# Altium schematic sheet 1_Main_核心板.schdoc.schdoc
size 431 x 309 mm; Symbol: Sheet-Symbol_A3; Device: Sheet-Symbol_A3; Company: 嘉立创EDA; Version: V1.0; Page Size: A3; @Project Name: 0117_230627_uMSX 4.0; @Page Count: 4; @Update Date: 2023-07-03; @Schematic Name: uMSX 4.0; @Page No: 1; @Page Name: Main/核心板
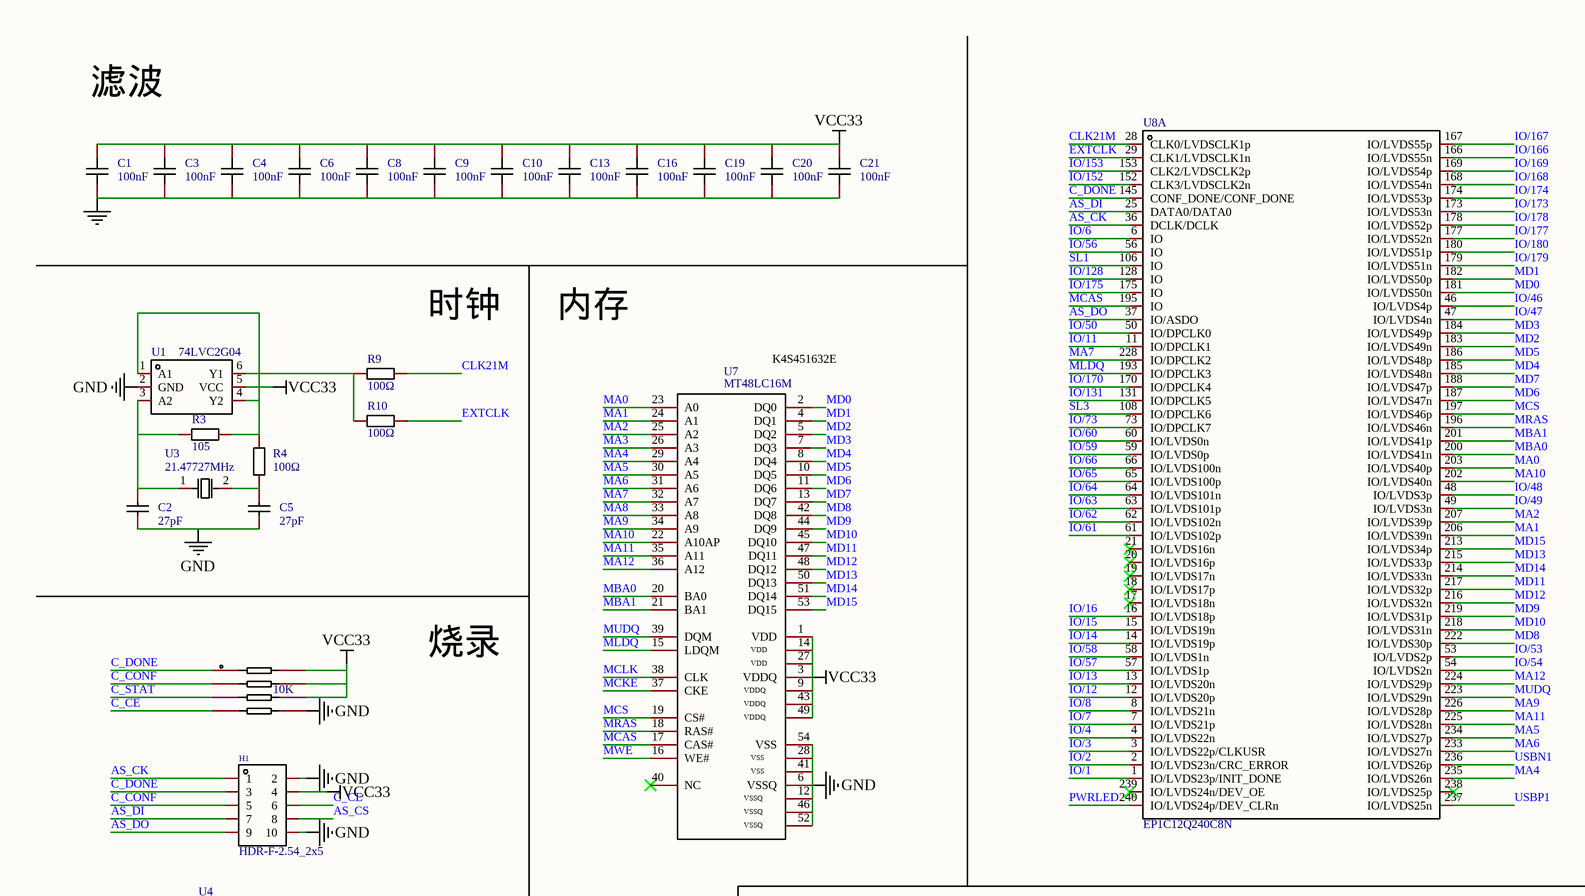
[diagram p0: 1_Main_核心板.schdoc.schdoc, top left]
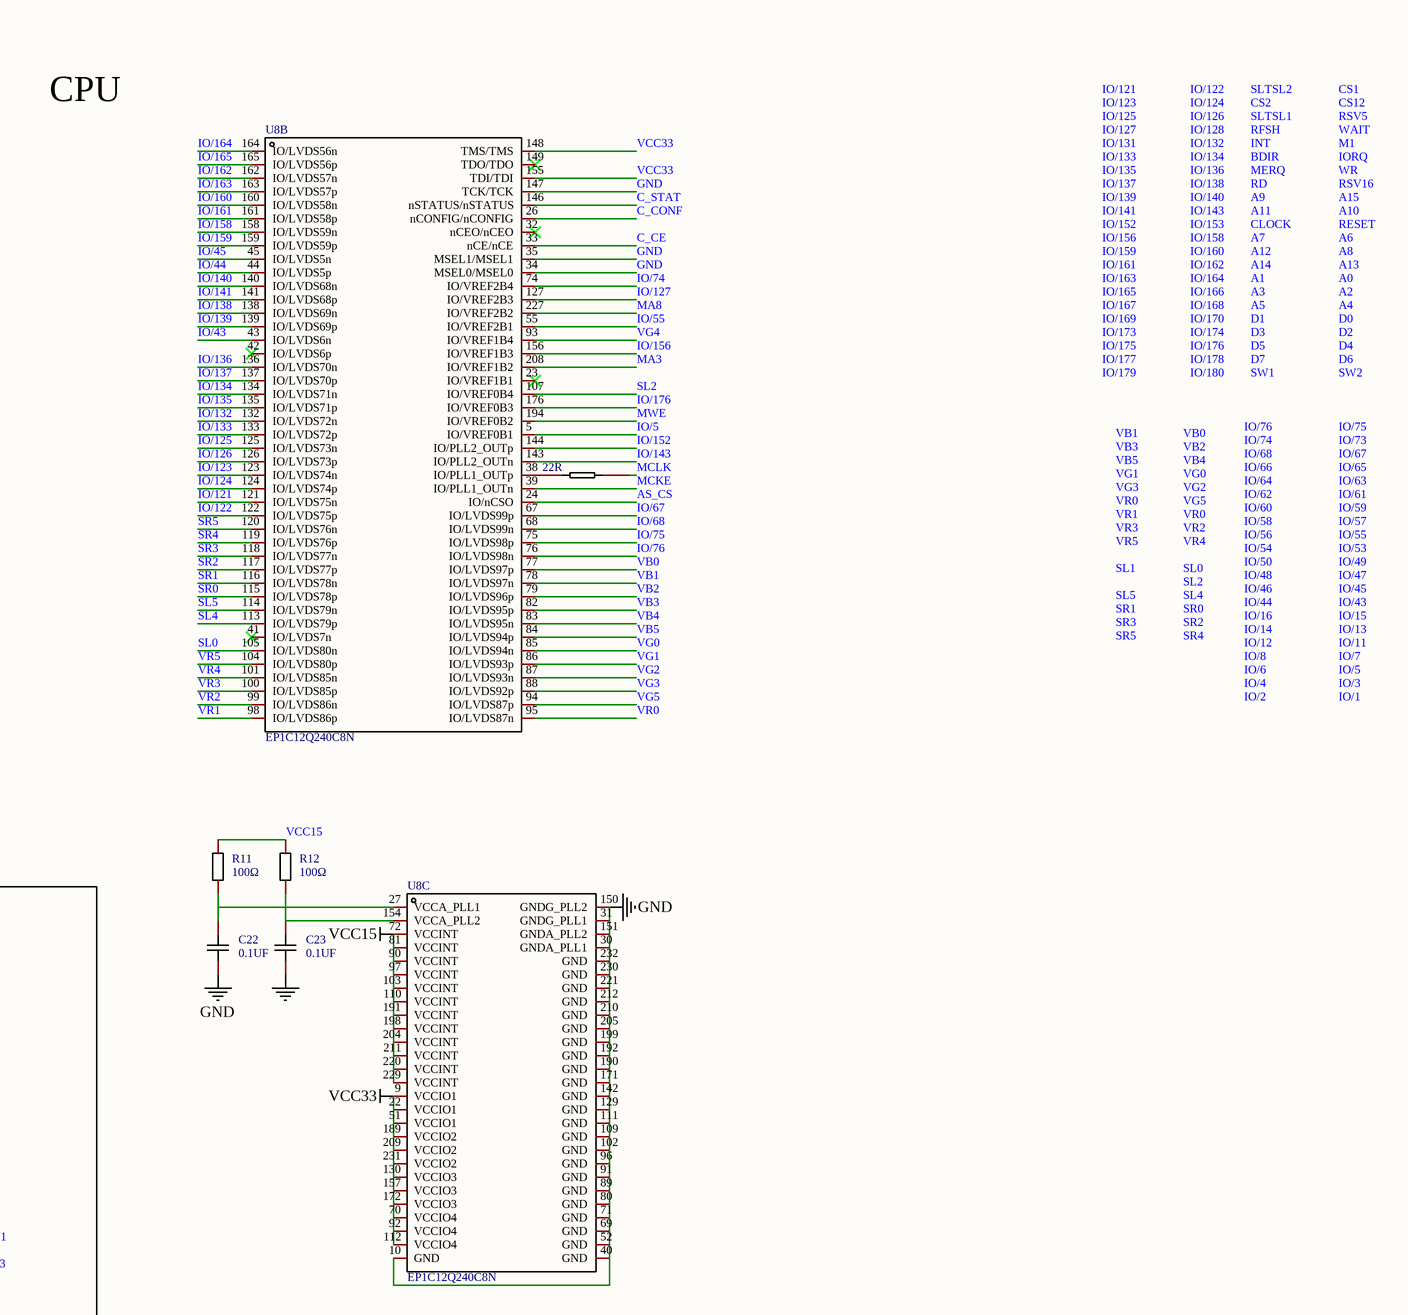
[diagram p1: 1_Main_核心板.schdoc.schdoc, top right]
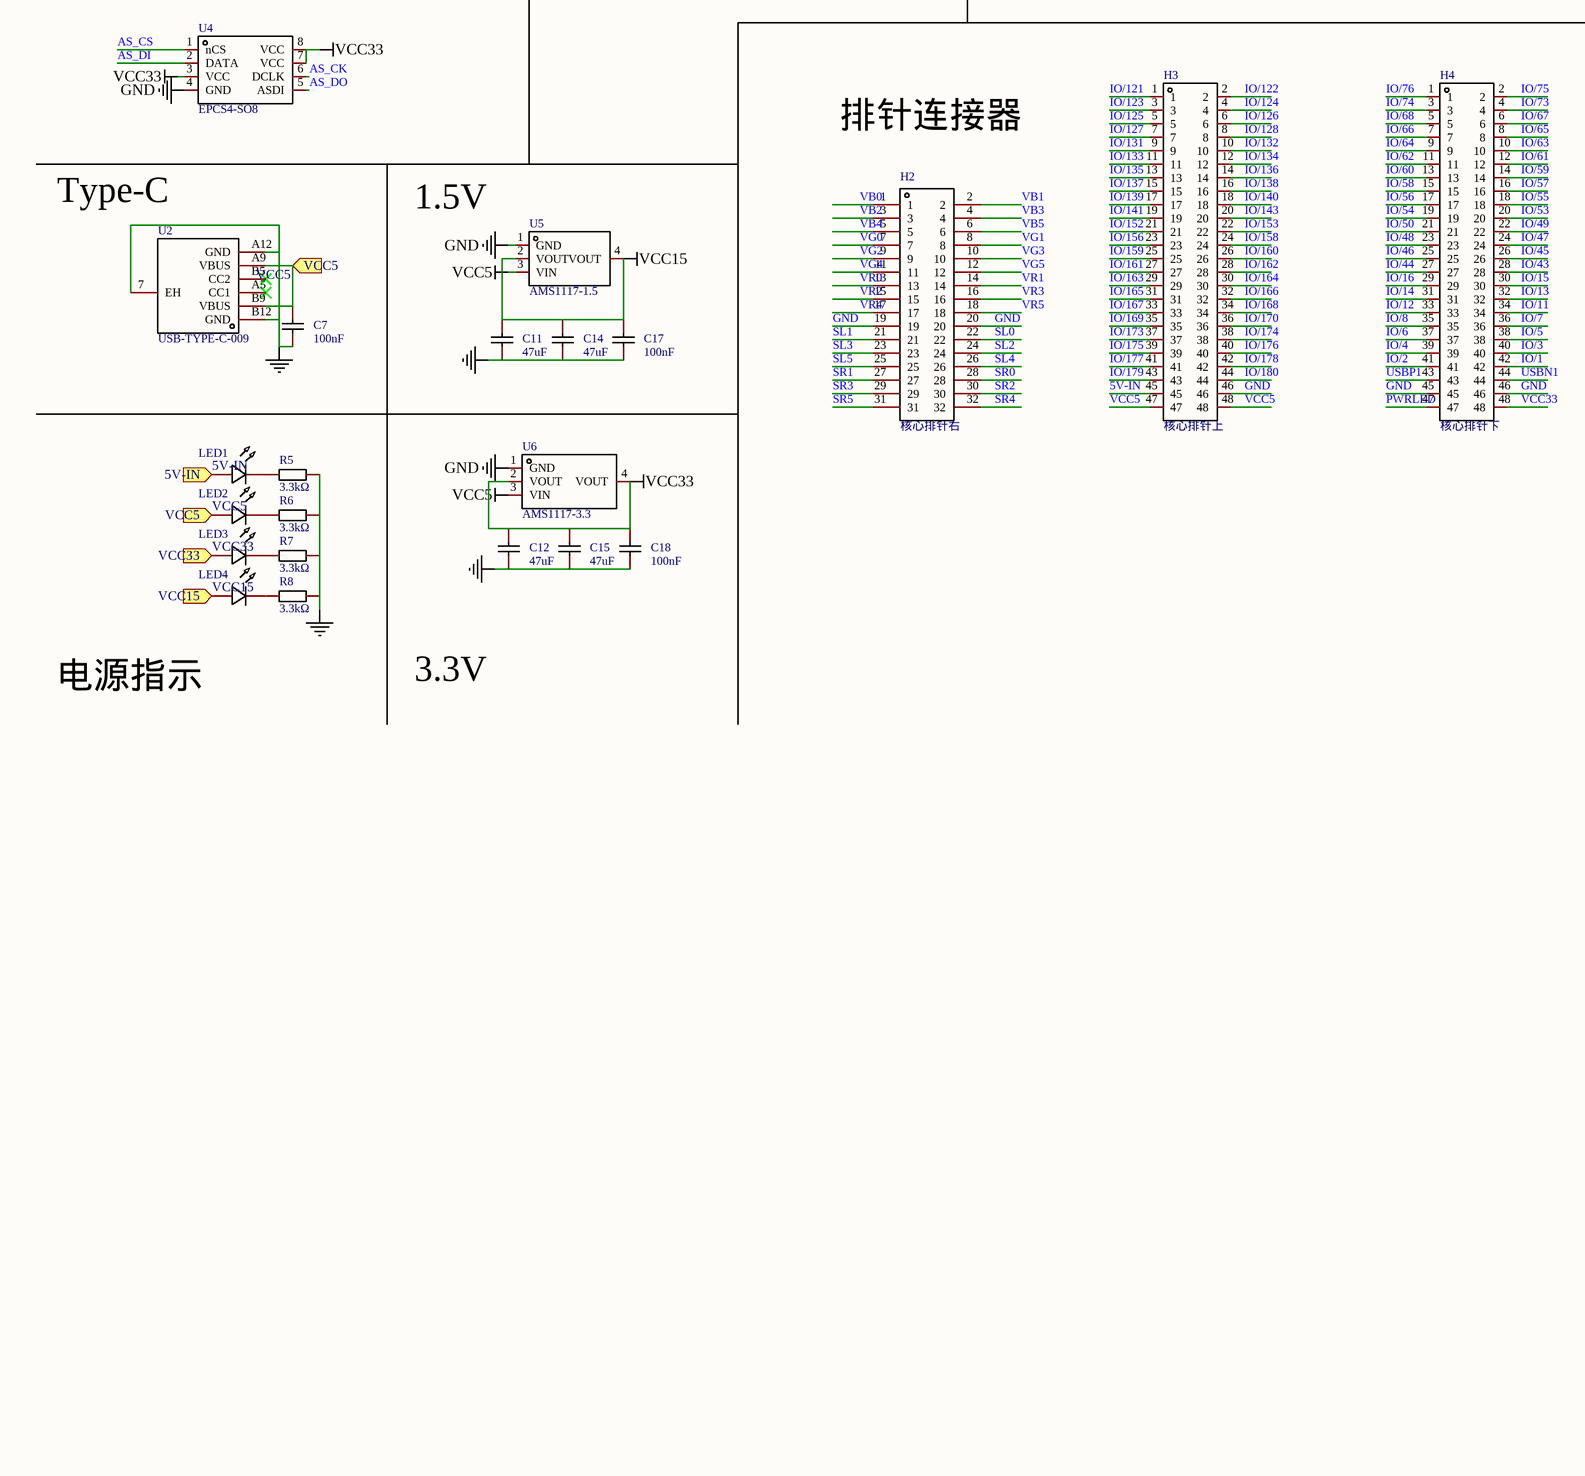
[diagram p2: 1_Main_核心板.schdoc.schdoc, bottom left]

## Parts
C1  100nF  [C0603]
C2  27pF  [C0603]
C3  100nF  [C0603]
C4  100nF  [C0603]
C5  27pF  [C0603]
C6  100nF  [C0603]
C7  100nF  [C0603]
C8  100nF  [C0603]
C9  100nF  [C0603]
C10  100nF  [C0603]
C11  47uF  [C0805]
C12  47uF  [C0805]
C13  100nF  [C0603]
C14  47uF  [C0805]
C15  47uF  [C0805]
C16  100nF  [C0603]
C17  100nF  [C0603]
C18  100nF  [C0603]
C19  100nF  [C0603]
C20  100nF  [C0603]
C21  100nF  [C0603]
C22  0.1UF  [C0603]
C23  0.1UF  [C0603]
H1  HDR-F-2.54_2x5  [HDR-TH_10P-P2.54-V-F-R2-C5-S2.54]
H2  核心排针右  [HDR-TH_32P-P2.54-V-M-R2-C16-S2.54]
H3  核心排针上  [HDR-TH_48P-2.54-V-M-R2-C24-S2.54]
H4  核心排针下  [HDR-TH_48P-2.54-V-M-R2-C24-S2.54]
LED1  LED_0603-R  [LED_0603]  (value not drawn)
LED2  LED_0603-R  [LED_0603]  (value not drawn)
LED3  LED_0603-R  [LED_0603]  (value not drawn)
LED4  LED_0603-R  [LED_0603]  (value not drawn)
R3  105  [R0603]
R4  100Ω  [R0603]
R5  3.3kΩ  [R0603_NEW]
R6  3.3kΩ  [R0603_NEW]
R7  3.3kΩ  [R0603_NEW]
R8  3.3kΩ  [R0603_NEW]
R9  100Ω  [R0603]
R10  100Ω  [R0603]
R11  100Ω  [R0603]
R12  100Ω  [R0603]
R13  22R  [R0603]
RN2  10K  [RES-ARRAY-SMD_0603-8P-L3.2-W1.6-BL]
U1  74LVC2G04  [SC-70-6_L2.2-W1.3-P0.65-LS2.1-BR]
U2  USB-TYPE-C-009  [TYPE-C-SMD_TYPE-C-6P]
U3  21.47727MHz  [HC-49US_L11.0-W4.6-P4.88]
U4  EPCS4-SO8  [SOP-8_L4.9-W3.9-P1.27-LS6.0-BL]
U5  AMS1117-1.5  [SOT-223_L6.3-W3.5-P2.30-LS7.0-BR]
U6  AMS1117-3.3  [SOT-223-3_L6.5-W3.4-P2.30-LS7.0-BR]
U7  MT48LC16M  [TSOP54]
U8  EP1C12Q240C8N  [MQFP-240_L32.0-W32.0-P0.50-LS34.6-BL]  (parts A,B,C of 3)

## Ports
5V-IN (in), VCC5 (in), VCC15 (in), VCC33 (in)

## Nets
GND: C2.1 C5.1 C22.2 H1.2 H1.10 H2.19 H2.20 H3.46 H4.45 H4.46 RN2.5 U1.2(GND) U4.4(GND) U5.1(GND) U6.1(GND) U7.6(VSSQ) U7.12(VSSQ) U7.28(VSS) U7.41(VSS) U7.46(VSSQ) U7.52(VSSQ) U7.54(VSS) U8.10(GND) U8.30(GNDA_PLL1) U8.31(GNDG_PLL1) U8.34(MSEL0/MSEL0) U8.35(MSEL1/MSEL1) U8.40(GND) U8.52(GND) U8.69(GND) U8.71(GND) U8.80(GND) U8.89(GND) U8.91(GND) U8.96(GND) U8.102(GND) U8.109(GND) U8.111(GND) U8.129(GND) U8.142(GND) U8.147(TCK/TCK) U8.150(GNDG_PLL2) U8.151(GNDA_PLL2) U8.171(GND) U8.190(GND) U8.192(GND) U8.199(GND) U8.205(GND) U8.210(GND) U8.212(GND) U8.221(GND) U8.230(GND) U8.232(GND)
NetC1_1: C1.1 C3.1 C4.1 C6.1 C7.1 C8.1 C9.1 C10.1 C11.1 C12.1 C13.1 C14.1 C15.1 C16.1 C17.1 C18.1 C19.1 C20.1 C21.1 C23.2 R5.2 R6.2 R7.2 R8.2 U2.7(EH) U2.A12(GND) U2.B12(GND)
VCC5: C7.2 H3.47 H3.48 LED2.2(A) U2.A9(VBUS) U2.B9(VBUS) U5.3(VIN) U6.3(VIN) ; port VCC5
VCC15: C11.2 C14.2 C17.2 LED4.2(A) R11.2 R12.2 U5.2(VOUT) U5.4(VOUT) U8.72(VCCINT) U8.81(VCCINT) U8.90(VCCINT) U8.97(VCCINT) U8.103(VCCINT) U8.110(VCCINT) U8.191(VCCINT) U8.198(VCCINT) U8.204(VCCINT) U8.211(VCCINT) U8.220(VCCINT) U8.229(VCCINT) ; port VCC15
VCC33: C1.2 C3.2 C4.2 C6.2 C8.2 C9.2 C10.2 C12.2 C13.2 C15.2 C16.2 C18.2 C19.2 C20.2 C21.2 H1.4 H4.48 LED3.2(A) RN2.6 RN2.7 RN2.8 U1.5(VCC) U4.3(VCC) U4.7(VCC) U4.8(VCC) U6.2(VOUT) U6.4(VOUT) U7.1(VDD) U7.3(VDDQ) U7.9(VDDQ) U7.14(VDD) U7.27(VDD) U7.43(VDDQ) U7.49(VDDQ) U8.9(VCCIO1) U8.22(VCCIO1) U8.51(VCCIO1) U8.70(VCCIO4) U8.92(VCCIO4) U8.112(VCCIO4) U8.130(VCCIO3) U8.148(TMS/TMS) U8.155(TDI/TDI) U8.157(VCCIO3) U8.172(VCCIO3) U8.189(VCCIO2) U8.209(VCCIO2) U8.231(VCCIO2) ; port VCC33
5V-IN: H3.45 LED1.2(A) ; port 5V-IN
AS_CK: H1.1 U4.6(DCLK) U8.36(DCLK/DCLK)
AS_CS: H1.8 U4.1(nCS) U8.24(IO/nCSO)
AS_DI: H1.7 U4.2(DATA) U8.25(DATA0/DATA0)
AS_DO: H1.9 U4.5(ASDI) U8.37(IO/ASDO)
C_CE: H1.6 RN2.4 U8.33(nCE/nCE)
C_CONF: H1.5 RN2.2 U8.26(nCONFIG/nCONFIG)
C_DONE: H1.3 RN2.1 U8.145(CONF_DONE/CONF_DONE)
C_STAT: RN2.3 U8.146(nSTATUS/nSTATUS)
CLK21M: R9.2 U8.28(CLK0/LVDSCLK1p)
EXTCLK: R10.2 U8.29(CLK1/LVDSCLK1n)
IO/1: H4.42 U8.1(IO/LVDS23p/INIT_DONE)
IO/2: H4.41 U8.2(IO/LVDS23n/CRC_ERROR)
IO/3: H4.40 U8.3(IO/LVDS22p/CLKUSR)
IO/4: H4.39 U8.4(IO/LVDS22n)
IO/5: H4.38 U8.5(IO/VREF0B1)
IO/6: H4.37 U8.6(IO)
IO/7: H4.36 U8.7(IO/LVDS21p)
IO/8: H4.35 U8.8(IO/LVDS21n)
IO/11: H4.34 U8.11(IO/DPCLK1)
IO/12: H4.33 U8.12(IO/LVDS20p)
IO/13: H4.32 U8.13(IO/LVDS20n)
IO/14: H4.31 U8.14(IO/LVDS19p)
IO/15: H4.30 U8.15(IO/LVDS19n)
IO/16: H4.29 U8.16(IO/LVDS18p)
IO/43: H4.28 U8.43(IO/LVDS6n)
IO/44: H4.27 U8.44(IO/LVDS5p)
IO/45: H4.26 U8.45(IO/LVDS5n)
IO/46: H4.25 U8.46(IO/LVDS4p)
IO/47: H4.24 U8.47(IO/LVDS4n)
IO/48: H4.23 U8.48(IO/LVDS3p)
IO/49: H4.22 U8.49(IO/LVDS3n)
IO/50: H4.21 U8.50(IO/DPCLK0)
IO/53: H4.20 U8.53(IO/LVDS2p)
IO/54: H4.19 U8.54(IO/LVDS2n)
IO/55: H4.18 U8.55(IO/VREF2B1)
IO/56: H4.17 U8.56(IO)
IO/57: H4.16 U8.57(IO/LVDS1p)
IO/58: H4.15 U8.58(IO/LVDS1n)
IO/59: H4.14 U8.59(IO/LVDS0p)
IO/60: H4.13 U8.60(IO/LVDS0n)
IO/61: H4.12 U8.61(IO/LVDS102p)
IO/62: H4.11 U8.62(IO/LVDS102n)
IO/63: H4.10 U8.63(IO/LVDS101p)
IO/64: H4.9 U8.64(IO/LVDS101n)
IO/65: H4.8 U8.65(IO/LVDS100p)
IO/66: H4.7 U8.66(IO/LVDS100n)
IO/67: H4.6 U8.67(IO/LVDS99p)
IO/68: H4.5 U8.68(IO/LVDS99n)
IO/73: H4.4 U8.73(IO/DPCLK7)
IO/74: H4.3 U8.74(IO/VREF2B4)
IO/75: H4.2 U8.75(IO/LVDS98p)
IO/76: H4.1 U8.76(IO/LVDS98n)
IO/121: H3.1 U8.121(IO/LVDS75n)
IO/122: H3.2 U8.122(IO/LVDS75p)
IO/123: H3.3 U8.123(IO/LVDS74n)
IO/124: H3.4 U8.124(IO/LVDS74p)
IO/125: H3.5 U8.125(IO/LVDS73n)
IO/126: H3.6 U8.126(IO/LVDS73p)
IO/127: H3.7 U8.127(IO/VREF2B3)
IO/128: H3.8 U8.128(IO)
IO/131: H3.9 U8.131(IO/DPCLK5)
IO/132: H3.10 U8.132(IO/LVDS72n)
IO/133: H3.11 U8.133(IO/LVDS72p)
IO/134: H3.12 U8.134(IO/LVDS71n)
IO/135: H3.13 U8.135(IO/LVDS71p)
IO/136: H3.14 U8.136(IO/LVDS70n)
IO/137: H3.15 U8.137(IO/LVDS70p)
IO/138: H3.16 U8.138(IO/LVDS69n)
IO/139: H3.17 U8.139(IO/LVDS69p)
IO/140: H3.18 U8.140(IO/LVDS68n)
IO/141: H3.19 U8.141(IO/LVDS68p)
IO/143: H3.20 U8.143(IO/PLL2_OUTn)
IO/152: H3.21 U8.144(IO/PLL2_OUTp) U8.152(CLK3/LVDSCLK2n)
IO/153: H3.22 U8.153(CLK2/LVDSCLK2p)
IO/156: H3.23 U8.156(IO/VREF1B3)
IO/158: H3.24 U8.158(IO/LVDS59n)
IO/159: H3.25 U8.159(IO/LVDS59p)
IO/160: H3.26 U8.160(IO/LVDS58n)
IO/161: H3.27 U8.161(IO/LVDS58p)
IO/162: H3.28 U8.162(IO/LVDS57n)
IO/163: H3.29 U8.163(IO/LVDS57p)
IO/164: H3.30 U8.164(IO/LVDS56n)
IO/165: H3.31 U8.165(IO/LVDS56p)
IO/166: H3.32 U8.166(IO/LVDS55n)
IO/167: H3.33 U8.167(IO/LVDS55p)
IO/168: H3.34 U8.168(IO/LVDS54n)
IO/169: H3.35 U8.169(IO/LVDS54p)
IO/170: H3.36 U8.170(IO/DPCLK4)
IO/173: H3.37 U8.173(IO/LVDS53n)
IO/174: H3.38 U8.174(IO/LVDS53p)
IO/175: H3.39 U8.175(IO)
IO/176: H3.40 U8.176(IO/VREF0B3)
IO/177: H3.41 U8.177(IO/LVDS52n)
IO/178: H3.42 U8.178(IO/LVDS52p)
IO/179: H3.43 U8.179(IO/LVDS51n)
IO/180: H3.44 U8.180(IO/LVDS51p)
MA0: U7.23(A0) U8.203(IO/LVDS40p)
MA1: U7.24(A1) U8.206(IO/LVDS39n)
MA2: U7.25(A2) U8.207(IO/LVDS39p)
MA3: U7.26(A3) U8.208(IO/VREF1B2)
MA4: U7.29(A4) U8.235(IO/LVDS26n)
MA5: U7.30(A5) U8.234(IO/LVDS27p)
MA6: U7.31(A6) U8.233(IO/LVDS27n)
MA7: U7.32(A7) U8.228(IO/DPCLK2)
MA8: U7.33(A8) U8.227(IO/VREF2B2)
MA9: U7.34(A9) U8.226(IO/LVDS28p)
MA10: U7.22(A10AP) U8.202(IO/LVDS40n)
MA11: U7.35(A11) U8.225(IO/LVDS28n)
MA12: U7.36(A12) U8.224(IO/LVDS29p)
MBA0: U7.20(BA0) U8.200(IO/LVDS41n)
MBA1: U7.21(BA1) U8.201(IO/LVDS41p)
MCAS: U7.17(CAS#) U8.195(IO)
MCKE: U7.37(CKE) U8.39(IO/PLL1_OUTn)
MCLK: R13.2 U7.38(CLK)
MCS: U7.19(CS#) U8.197(IO/LVDS46p)
MD0: U7.2(DQ0) U8.181(IO/LVDS50n)
MD1: U7.4(DQ1) U8.182(IO/LVDS50p)
MD2: U7.5(DQ2) U8.183(IO/LVDS49n)
MD3: U7.7(DQ3) U8.184(IO/LVDS49p)
MD4: U7.8(DQ4) U8.185(IO/LVDS48n)
MD5: U7.10(DQ5) U8.186(IO/LVDS48p)
MD6: U7.11(DQ6) U8.187(IO/LVDS47n)
MD7: U7.13(DQ7) U8.188(IO/LVDS47p)
MD8: U7.42(DQ8) U8.222(IO/LVDS30p)
MD9: U7.44(DQ9) U8.219(IO/LVDS31p)
MD10: U7.45(DQ10) U8.218(IO/LVDS31n)
MD11: U7.47(DQ11) U8.217(IO/LVDS32p)
MD12: U7.48(DQ12) U8.216(IO/LVDS32n)
MD13: U7.50(DQ13) U8.215(IO/LVDS33p)
MD14: U7.51(DQ14) U8.214(IO/LVDS33n)
MD15: U7.53(DQ15) U8.213(IO/LVDS34p)
MLDQ: U7.15(LDQM) U8.193(IO/DPCLK3)
MRAS: U7.18(RAS#) U8.196(IO/LVDS46n)
MUDQ: U7.39(DQM) U8.223(IO/LVDS29n)
MWE: U7.16(WE#) U8.194(IO/VREF0B2)
PWRLED: H4.47 U8.240(IO/LVDS24p/DEV_CLRn)
SL0: H2.22 U8.105(IO/LVDS80n)
SL1: H2.21 U8.106(IO)
SL2: H2.24 U8.107(IO/VREF0B4)
SL3: H2.23 U8.108(IO/DPCLK6)
SL4: H2.26 U8.113(IO/LVDS79p)
SL5: H2.25 U8.114(IO/LVDS79n)
SR0: H2.28 U8.115(IO/LVDS78p)
SR1: H2.27 U8.116(IO/LVDS78n)
SR2: H2.30 U8.117(IO/LVDS77p)
SR3: H2.29 U8.118(IO/LVDS77n)
SR4: H2.32 U8.119(IO/LVDS76p)
SR5: H2.31 U8.120(IO/LVDS76n)
USBN1: H4.44 U8.236(IO/LVDS26p)
USBP1: H4.43 U8.237(IO/LVDS25n)
VB0: H2.1 U8.77(IO/LVDS97p)
VB1: H2.2 U8.78(IO/LVDS97n)
VB2: H2.3 U8.79(IO/LVDS96p)
VB3: H2.4 U8.82(IO/LVDS95p)
VB4: H2.5 U8.83(IO/LVDS95n)
VB5: H2.6 U8.84(IO/LVDS94p)
VG0: H2.7 U8.85(IO/LVDS94n)
VG1: H2.8 U8.86(IO/LVDS93p)
VG2: H2.9 U8.87(IO/LVDS93n)
VG3: H2.10 U8.88(IO/LVDS92p)
VG4: H2.11 U8.93(IO/VREF1B4)
VG5: H2.12 U8.94(IO/LVDS87p)
VR0: H2.13 U8.95(IO/LVDS87n)
VR1: H2.14 U8.98(IO/LVDS86p)
VR2: H2.15 U8.99(IO/LVDS86n)
VR3: H2.16 U8.100(IO/LVDS85p)
VR4: H2.17 U8.101(IO/LVDS85n)
VR5: H2.18 U8.104(IO/LVDS80p)
NetC2_2: C2.2 R3.1 U1.3(A2) U3.1(OSC1)
NetC5_2: C5.2 R4.1 U3.2(OSC2)
NetC22_1: C22.1 R11.1 U8.27(VCCA_PLL1)
NetC23_1: C23.1 R12.1 U8.154(VCCA_PLL2)
NetLED1_1: LED1.1(C) R5.1
NetLED2_1: LED2.1(C) R6.1
NetLED3_1: LED3.1(C) R7.1
NetLED4_1: LED4.1(C) R8.1
NetR3_2: R3.2 R4.2 U1.1(A1) U1.4(Y2)
NetR9_1: R9.1 R10.1 U1.6(Y1)
NetR13_1: R13.1 U8.38(IO/PLL1_OUTp)

Not connected (* = marked no-connect by the designer): U2 A5(CC1)* B5(CC2)*; U7 40(NC)*; U8 17(IO/LVDS18n)* 18(IO/LVDS17p)* 19(IO/LVDS17n)* 20(IO/LVDS16p)* 21(IO/LVDS16n)* 23(IO/VREF1B1)* 32(nCEO/nCEO)* 41(IO/LVDS7n)* 42(IO/LVDS6p)* 149(TDO/TDO)* 238(IO/LVDS25p)* 239(IO/LVDS24n/DEV_OE)*

## Notes on the sheet
- 滤波
- CPU
- 时钟
- 内存
- (near U7) K4S451632E
- 烧录
- 排针连接器
- (near U2) Type-C
- (near U5) 1.5V
- 电源指示
- 3.3V
- Labels drawn without touching a wire or pin: A0, A1, A2, A3, A4, A5, A6, A7, A8, A9, A10, A11, A12, A13, A14, A15, BDIR, CLOCK, CS1, CS2, CS12, D0, D1, D2, D3, D4, D5, D6, D7, INT, IO/1, IO/2, IO/3, IO/4, IO/5, IO/6, IO/7, IO/8, IO/11, IO/12, IO/13, IO/14, IO/15, IO/16, IO/43, IO/44, IO/45, IO/46, IO/47, IO/48, IO/49, IO/50, IO/53, IO/54, IO/55, IO/56, IO/57, IO/58, IO/59, IO/60, IO/61, IO/62, IO/63, IO/64, IO/65, IO/66, IO/67, IO/68, IO/73, IO/74, IO/75, IO/76, IO/121, IO/122, IO/123, IO/124, IO/125, IO/126, IO/127, IO/128, IO/131, IO/132, IO/133, IO/134, IO/135, IO/136, IO/137, IO/138, IO/139, IO/140, IO/141, IO/143, IO/152, IO/153, IO/156, IO/158, IO/159, IO/160, IO/161, IO/162, IO/163, IO/164, IO/165, IO/166, IO/167, IO/168, IO/169, IO/170, IO/173, IO/174, IO/175, IO/176, IO/177, IO/178, IO/179, IO/180, IORQ, M1, MERQ, RD, RESET, RFSH, RSV5, RSV16, SL0, SL1, SL2, SL4, SL5, SLTSL1, SLTSL2, SR0, SR1, SR2, SR3, SR4, SR5, SW1, SW2, VB0, VB1, VB2, VB3, VB4, VB5, VG0, VG1, VG2, VG3, VG5, VR0, VR1, VR2, VR3, VR4, VR5, WAIT, WR
- 1
- 2
- 3
- 4
- 5
- 6
- A
- B
- C
- Schematic
- uMSX 4.0
- Create Date
- Update Date
- 2023-07-03
- D
- Reviewed
- Drawed
- Page
- Main/核心板
- Part Number
- 0117_230627_uMSX 4.0
- VER
- SIZE
- PAGE
- OF
- V1.0
- A3
- 嘉立创EDA

## Library data of the parts
C1 C3 C4 C6 C8-C10 C13 C16 C19-C21 = CC0603KRX7R9BB104: Manufacturer: YAGEO(国巨); Add into BOM: yes; Tolerance: ±10%; Voltage Rated: 50V; Temperature Coefficient: X7R; Description: 容值:100nF;精度:±10%;额定电压:50V;材质(温度系数):X7R;; Name: 100nF; Symbol: CC0603KRX7R9BB104; Device: CC0603KRX7R9BB104; LCSC Part Name: 100nF ±10% 50V; Supplier Part: C14663; Manufacturer Part: CC0603KRX7R9BB104; Supplier Footprint: 0603; JLCPCB Part Class: Basic Part; Datasheet: https://atta.szlcsc.com/upload/public/pdf/source/20180910/C282072_33301C7F631E79921B82A8DAC6BCC5B3.pdf; Supplier: LCSC; Convert to PCB: yes; Value: 100nF
C2 C5 = CC0603JRNPO9BN270: Manufacturer: YAGEO(国巨); Add into BOM: yes; Tolerance: ±5%; Voltage Rated: 50V; Temperature Coefficient: NP0; Description: 容值:27pF;精度:±5%;额定电压:50V;材质(温度系数):NP0;; Name: 27pF; Symbol: CC0603JRNPO9BN270; Device: CC0603JRNPO9BN270; LCSC Part Name: 27pF ±5% 50V; Supplier Part: C107045; Manufacturer Part: CC0603JRNPO9BN270; Supplier Footprint: 0603; JLCPCB Part Class: Basic Part; Datasheet: https://atta.szlcsc.com/upload/public/pdf/source/20170420/1492670692625.pdf; Supplier: LCSC; Convert to PCB: yes; Value: 27pF
C7 C17 C18 = 0603B104K500NT: Manufacturer: FH(风华); Add into BOM: yes; Tolerance: ±10%; Voltage Rated: 50V; Temperature Coefficient: X7R; Description: 容值:100nF;精度:±10%;额定电压:50V;材质(温度系数):X7R;; Name: 100nF; Symbol: 0603B104K500NT; Device: 0603B104K500NT; LCSC Part Name: 100nF ±10% 50V; Supplier Part: C30926; Manufacturer Part: 0603B104K500NT; Supplier Footprint: 0603; JLCPCB Part Class: Extended Part; Datasheet: https://atta.szlcsc.com/upload/public/pdf/source/20170923/C30926_1506149436298988724.pdf; Supplier: LCSC; Convert to PCB: yes; Value: 100nF
C11 C12 C14 C15 = CL21A476MQYNNNE: Manufacturer: SAMSUNG(三星); Add into BOM: yes; Tolerance: ±20%; Voltage Rated: 6.3V; Temperature Coefficient: X5R; Description: 容值:47uF;精度:±20%;额定电压:6.3V;材质(温度系数):X5R;; Name: 47uF; Symbol: CL21A476MQYNNNE; Device: CL21A476MQYNNNE; LCSC Part Name: 47uF ±20% 6.3V; Supplier Part: C16780; Manufacturer Part: CL21A476MQYNNNE; Supplier Footprint: 0805; JLCPCB Part Class: Basic Part; Datasheet: https://atta.szlcsc.com/upload/public/pdf/source/20160103/1457707690276.pdf; Supplier: LCSC; Convert to PCB: yes; Value: 47uF
C22 C23 = 0.1UF: 3DModel: C0603_L1.6-W0.8-H0.8; Add into BOM: yes; Name: 0.1UF; Symbol: 0.1UF; Device: 0.1UF; link: https://item.szlcsc.com/362304.html; Convert to PCB: yes; Origin Footprint: C0603
H1 = 排母2.54mm2*5p 直: Manufacturer: BOOMELE(博穆精密); Symbol: Female header2.54mm2*5p Straight; Add into BOM: yes; Number of Holes: 10P; Pitch: 2.54mm; Description: 排数:双排;总孔位数:10P;间距:2.54mm;行距:2.54mm;安装类型:直插;塑高:-;触头材质:黄铜;触头镀层:-;; Name: HDR-F-2.54_2x5; Device: 排母2.54mm2*5p 直; Supplier Part: C30419; Supplier: LCSC; Manufacturer Part: HDR-F-2.54_2x5; JLCPCB Part Class: Extended Part; LCSC Part Name: 2.54mm; Supplier Footprint: 插件,P=2.54mm; Convert to PCB: yes; Number of Rows: 双排; Row Spacing: 2.54mm; Mounting Type: 直插; Insulation Height: -; Contact Material: 黄铜; Contact Plating: -
H2 = B-2100S32P-B110: Manufacturer: Ckmtw(灿科盟); Symbol: 210S-2*16P L=11.6MMGold-plated black; Add into BOM: yes; Pitch: 2.54mm; Pin Structure: 2x16P; Description: 排数:双排;总PIN位数:32;间距:2.54mm;插针结构:2x16P;行距:2.54mm;安装类型:直插;圆针/方针:-;额定电流:-;额定电压:-;配合针长度:6mm;塑高:2.54mm;端接针长度:3mm;触头材质:黄铜;触头镀层:-;工作温度范围:-40℃~+105℃;颜色:黑色;; Name: 核心排针右; Device: B-2100S32P-B110; LCSC Part Name: 2.54mm 2x16P 直插; Supplier Part: C124382; Manufacturer Part: 核心排针右; Supplier Footprint: 直插,P=2.54mm; JLCPCB Part Class: Extended Part; Datasheet: https://atta.szlcsc.com/upload/public/pdf/source/20170821/C124382_1503303309726901536.pdf; Supplier: LCSC; Convert to PCB: yes; Number of Rows: 双排; Number of Pins: 32; Row Spacing: 2.54mm; Mounting Type: 直插; Circluar Pins/Square Pins: -; Current Rating (Max): -; Voltage Rating (Max): -; Length of Mating Pin: 6mm; Insulation Height: 2.54mm; Length of End Connection Pin: 3mm; Contact Material: 黄铜; Contact Plating: -; Operating Temperature Range: -40℃~+105℃; Color: 黑色
H3 H4 = X6521WV-2x24H-C60D30: Manufacturer: XKB Connectivity(中国星坤); Symbol: X6521WV-2×24H-C30D60; Add into BOM: yes; Pitch: 2.54mm; Pin Structure: 2x24P; Circluar Pins/Square Pins: 方针; Current Rating (Max): 3A; Voltage Rating (Max): 250V; Welding Temperature (Max): 260℃; Description: 排数:双排;总PIN位数:48;间距:2.54mm;插针结构:2x24P;行距:2.54mm;安装类型:直插;圆针/方针:方针;额定电流:3A;额定电压:250V;配合针长度:6mm;塑高:2.5mm;端接针长度:3mm;触头材质:黄铜;触头镀层:金;工作温度范围:-40℃~+105℃;焊接温度(最大值):260℃;颜色:黑色;; Device: X6521WV-2x24H-C60D30; LCSC Part Name: 2.54mm 2x24P 直插 方针 高镀金 抗氧化; Supplier Part: C725896; Supplier Footprint: 插件,P=2.54mm; JLCPCB Part Class: Extended Part; Datasheet: https://atta.szlcsc.com/upload/public/pdf/source/20211009/DE33EBA4104B5B447A7BD8383FBBA145.pdf; Supplier: LCSC; Convert to PCB: yes; Number of Rows: 双排; Number of Pins: 48; Row Spacing: 2.54mm; Mounting Type: 直插; Length of Mating Pin: 6mm; Insulation Height: 2.5mm; Length of End Connection Pin: 3mm; Contact Material: 黄铜; Contact Plating: 金; Operating Temperature Range: -40℃~+105℃; Color: 黑色
  H3: Name: 核心排针上; Manufacturer Part: 核心排针上
  H4: Name: 核心排针下; Manufacturer Part: 核心排针下
LED1-LED4 = LED_0603-R: Symbol: LED_R; Convert to PCB: yes; Device: LED_0603-R; Add into BOM: yes; Supplier Footprint: 0603
R3 = 0603WAF1004T5E: Manufacturer: UNI-ROYAL(厚声); Add into BOM: yes; Tolerance: ±1%; Power(Watts): 100mW; Temperature Coefficient: ±100ppm/℃; Overload Voltage (Max): 75V; Description: 电阻类型:厚膜电阻;阻值:1MΩ;精度:±1%;功率:100mW;; Name: 105; Symbol: 0603WAF1004T5E; Device: 0603WAF1004T5E; LCSC Part Name: 1MΩ ±1% 100mW; Supplier Part: C22935; Manufacturer Part: 0603WAF1004T5E; Supplier Footprint: 0603; JLCPCB Part Class: Basic Part; Datasheet: https://atta.szlcsc.com/upload/public/pdf/source/20200306/C422600_1E6D84923E4A46A82E41ADD87F860B5C.pdf; Supplier: LCSC; Convert to PCB: yes; Type: 厚膜电阻; Value: 105; Operating Temperature Range: -55℃~+155℃
R4 R9-R12 = 0603WAF1000T5E: Manufacturer: UNI-ROYAL(厚声); Add into BOM: yes; Tolerance: ±1%; Power(Watts): 100mW; Temperature Coefficient: ±200ppm/℃; Overload Voltage (Max): 75V; Description: 电阻类型:厚膜电阻;阻值:100Ω;精度:±1%;功率:100mW;; Name: 100Ω; Symbol: 0603WAF1000T5E; Device: 0603WAF1000T5E; LCSC Part Name: 100Ω ±1% 100mW; Supplier Part: C22775; Manufacturer Part: 0603WAF1000T5E; Supplier Footprint: 0603; JLCPCB Part Class: Basic Part; Datasheet: https://atta.szlcsc.com/upload/public/pdf/source/20200306/C422600_1E6D84923E4A46A82E41ADD87F860B5C.pdf; Supplier: LCSC; Convert to PCB: yes; Type: 厚膜电阻; Value: 100Ω; Operating Temperature Range: -55℃~+155℃
R5-R8 = 0603WAF3301T5E: Manufacturer: UNI-ROYAL(厚声); Add into BOM: yes; Tolerance: ±1%; Power(Watts): 100mW; Temperature Coefficient: ±100ppm/℃; Overload Voltage (Max): 75V; Description: 电阻类型:厚膜电阻;阻值:3.3kΩ;精度:±1%;功率:100mW;; Name: 3.3kΩ; Symbol: 0603WAF3301T5E; Device: 0603WAF3301T5E; LCSC Part Name: 3.3kΩ ±1% 100mW; Supplier Part: C22978; Manufacturer Part: 0603WAF3301T5E; Supplier Footprint: 0603; JLCPCB Part Class: Basic Part; Datasheet: https://atta.szlcsc.com/upload/public/pdf/source/20200306/C422600_1E6D84923E4A46A82E41ADD87F860B5C.pdf; Supplier: LCSC; Convert to PCB: yes; Type: 厚膜电阻; Value: 3.3kΩ; Operating Temperature Range: -55℃~+155℃
R13 = Res_0603: Symbol: 电阻; Convert to PCB: yes; Name: 22R; Device: Res_0603; Add into BOM: yes; Supplier Footprint: 0603; Value: 22R
RN2 = 4D03WGJ0101T5E: Manufacturer: UNI-ROYAL(厚声); Add into BOM: yes; Tolerance: ±5%; Power(Watts): 62.5mW; Number of Resistors: 4; Temperature Coefficient: ±200ppm/℃; Description: 阻值:100Ω;精度:±5%;单个元件功率:62.5mW;电阻器数:4;; Name: 10K; Symbol: 4D03WGJ0101T5E; Device: 4D03WGJ0101T5E; LCSC Part Name: 100Ω ±5%; Supplier Part: C25506; Manufacturer Part: 4D03WGJ0101T5E; Supplier Footprint: 0603x4; JLCPCB Part Class: Extended Part; Datasheet: https://atta.szlcsc.com/upload/public/pdf/source/20170615/1497510993674.pdf; Supplier: LCSC; Convert to PCB: yes; Value: 10K; Number of Pins: 8
U1 = NC7WZU04P6X: Manufacturer: onsemi(安森美); Add into BOM: yes; Number of channels: 2; Supply Voltage(Single): 1.8V~5.5V; Supply Current (Max): 1uA; Sink Current: 8mA; Max Propagation Delay: 5.6ns@5V,50pF; Description: 输入类型:-;通道数:2;电源电压:1.8V~5.5V;电源电流(最大值):1uA;灌电流(IOL):8mA;拉电流(IOH):8mA;最大传播延迟(tpd):5.6ns@5V,50pF;; Name: 74LVC2G04; Symbol: NC7WZU04P6X; Device: NC7WZU04P6X; LCSC Part Name: NC7WZU04P6X; Supplier Part: C128373; Manufacturer Part: 74LVC2G04; Supplier Footprint: SC-70-6(SOT-363); JLCPCB Part Class: Extended Part; Datasheet: https://atta.szlcsc.com/upload/public/pdf/source/20170914/C128373_1505359757804967915.pdf; Supplier: LCSC; Convert to PCB: yes; Input Type: -; Source Current: 8mA; High level range (VIH): -; Low level range (VIL): -
U2 = USB-TYPE-C-009: Manufacturer: DEALON(德艺隆); Add into BOM: yes; Connector Type: Type-C; Gender: 母座; Number of Contacts: 6; Number of Ports: 1; Current Rating - Power (Max): 5A; Description: 连接器类型:Type-C;标准:-;公母:母座;触点数量:6;端口数量:1;安装方式:卧贴;额定电流 - 电源:5A;工作温度范围:-25℃~+85℃;; Name: USB-TYPE-C-009; Symbol: USB-TYPE-C-009; Device: USB-TYPE-C-009; LCSC Part Name: Type-C 母座 卧贴; Supplier Part: C2927029; Manufacturer Part: USB-TYPE-C-009; Supplier Footprint: SMD; JLCPCB Part Class: Extended Part; Datasheet: https://atta.szlcsc.com/upload/public/pdf/source/20211217/1285E39CB33F6A7DB557CB6D0A3C6F17.pdf; Supplier: LCSC; Convert to PCB: yes; Standard: -; Mounting Style: 卧贴; Operating Temperature Range: -25℃~+85℃
U3 = ECS-214.7-S-4: Manufacturer: ECS; Add into BOM: yes; Frequency Tolerance: ±30ppm; Frequency Stability: ±50ppm; Equivalent Series Resistance (ESR): 30Ω; Description: 频率:21.47727MHz;频率公差:±30ppm;频率稳定度:±50ppm;负载电容:-;; Name: 21.47727MHz; Symbol: ECS-214.7-S-4; Device: ECS-214.7-S-4; LCSC Part Name: 21.47727MHz ±30ppm; Supplier Part: C2636320; Manufacturer Part: ECS-214.7-S-4; Supplier Footprint: -; JLCPCB Part Class: Extended Part; Datasheet: https://atta.szlcsc.com/upload/public/pdf/source/20210402/81F084B668D60DFAE850A61100CCABAF.pdf; Supplier: LCSC; Convert to PCB: yes; Value: 21.47727MHz; Load Capacitance: -; Operating Temperature: -10℃~+70℃
U4 = EPCS4-SO8: Add into BOM: yes; Name: EPCS4-SO8; Symbol: EPCS4-SO8; Device: EPCS4-SO8; LCSC Part Name: EPCS4-SO8; Supplier Part: C9900008972; Manufacturer Part: EPCS4-SO8; Supplier Footprint: SOP-8_L4.9-W3.9-P1.27-LS6.0-BL; JLCPCB Part Class: Extended Part; Datasheet: https://atta.szlcsc.comnull; Supplier: LCSC; Convert to PCB: yes
U5 = AMS1117-1.5_C963403: Manufacturer: JSMSEMI(杰盛微); Add into BOM: yes; Description: 输出类型:-;; Name: AMS1117-1.5; Symbol: AMS1117-1.5_C963403; Device: AMS1117-1.5_C963403; LCSC Part Name: AMS1117-1.5; Supplier Part: C963403; Manufacturer Part: AMS1117-1.5; Supplier Footprint: SOT-223; JLCPCB Part Class: Extended Part; Datasheet: https://atta.szlcsc.com/upload/public/pdf/source/20211201/578FEEF9766904D398893791CE3EC879.pdf; Supplier: LCSC; Convert to PCB: yes; Output Type: -
U6 = AMS1117-3.3_C6186: Manufacturer: AMS; Add into BOM: yes; Output Type: 固定; Output Polarity: 正; Number of Outputs: 1; Output Voltage: 3.3V; Dropout Voltage: 1.3V@(800mA); Output Current: 1A; Power Supply Rejection Ratio (PSRR): 72dB@(120Hz); Description: 输出类型:固定;输出极性:正;最大输入电压:-;输出电压:3.3V;输出电流:1A;电源纹波抑制比(PSRR):72dB@(120Hz);; Name: AMS1117-3.3; Symbol: AMS1117-3.3; Device: AMS1117-3.3_C6186; LCSC Part Name: 输出3.3V 1A; Supplier Part: C6186; Manufacturer Part: AMS1117-3.3; Supplier Footprint: SOT-223; JLCPCB Part Class: Basic Part; Datasheet: https://atta.szlcsc.com/upload/public/pdf/source/20180727/C6186_7A095716F0823C02F1997A905E26C086.pdf; Supplier: LCSC; Convert to PCB: yes; Maximum Input Voltage: -; Quiescent Current (Ground Current): -; Noise: -; Feature: -; Operating Temperature: -
U7 = MT48LC16M: Add into BOM: yes; Name: MT48LC16M; Symbol: MT48LC16M; Device: MT48LC16M; Convert to PCB: yes; Origin Footprint: TSOP54
U8 = EP1C12Q240C8N: Manufacturer: Intel/Altera; Add into BOM: yes; Name: EP1C12Q240C8N; Symbol: EP1C12Q240C8N; Device: EP1C12Q240C8N; LCSC Part Name: EP1C12Q240C8N; Supplier Part: C568984; Manufacturer Part: EP1C12Q240C8N; Supplier Footprint: MQFP-240(32x32); JLCPCB Part Class: Extended Part; Datasheet: https://atta.szlcsc.com/upload/public/pdf/source/20191127/C464479_612FAD7AB9F2A350E838DC28A08A3D1E.pdf; Supplier: LCSC; Convert to PCB: yes